# EAGLE design breakout (EAGLE 6.2)
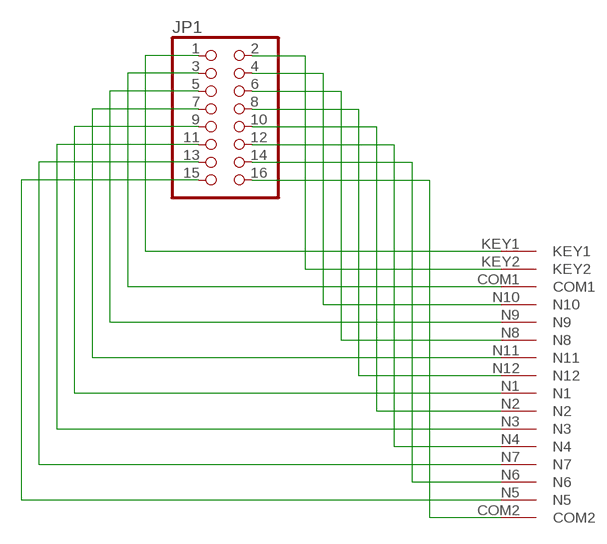
[diagram p0: schematic, sheet 1]

## Parts
JP1  PINHD-2X8  [2X08]
U$1  CON_16X1  [CON_16X1]

## Nets
N$1: JP1.1 U$1.KEY1
N$2: JP1.2 U$1.KEY2
N$3: JP1.3 U$1.COM1
N$4: JP1.4 U$1.N10
N$5: JP1.5 U$1.N9
N$6: JP1.6 U$1.N8
N$7: JP1.7 U$1.N11
N$8: JP1.8 U$1.N12
N$9: JP1.9 U$1.N1
N$10: JP1.10 U$1.N2
N$11: JP1.11 U$1.N3
N$12: JP1.12 U$1.N4
N$13: JP1.13 U$1.N7
N$14: JP1.14 U$1.N6
N$15: JP1.15 U$1.N5
N$16: JP1.16 U$1.COM2

## Library data of the parts
JP1 = pinhead:PINHD-2X8: PIN HEADER
U$1 = matt4eagle:CON_16X1

## Board
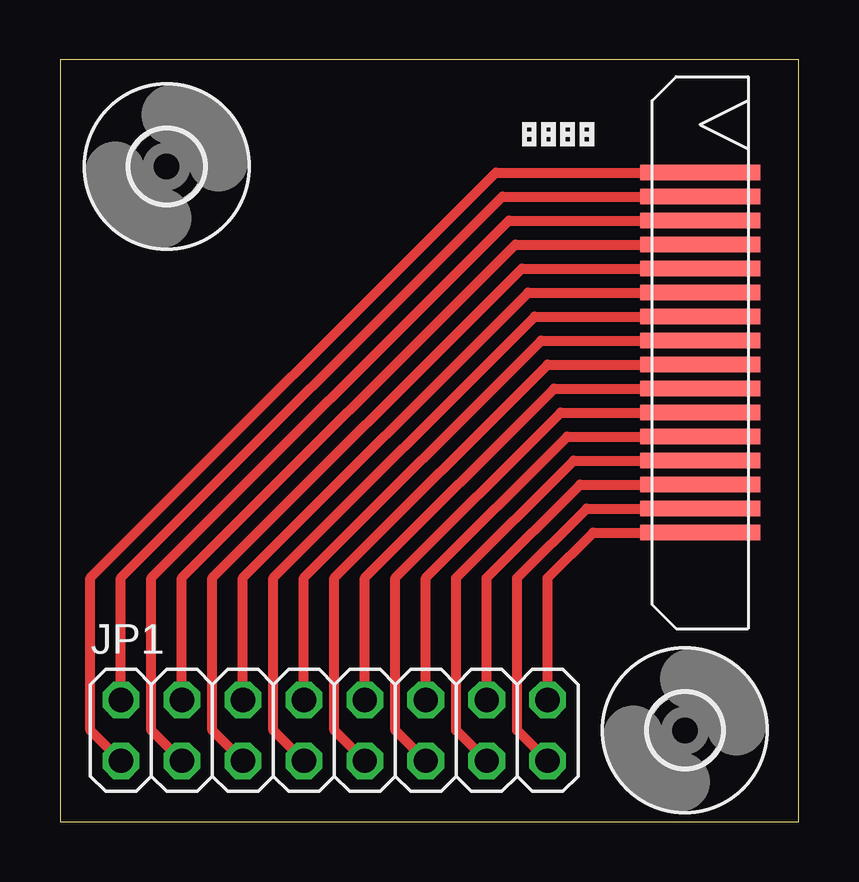
[diagram p1: board, top side]

Size 30.79 x 31.74 mm. Coordinates in mm from the lower left corner, seen from the top.
Outline: 0,0 30.79,0 30.79,31.74 0,31.74 0,0
Copper layers (1*16): Top 0.035mm / dielectric 1.5mm / Bottom 0.035mm
Design rules: minimum track width 0.15mm, minimum drill 0.3mm, track to track 0.15mm, track to pad 0.15mm, pad to pad 0.15mm, via to via 0.15mm, smd to smd 0mil, copper to edge 0.2mm, drill to drill 0.2mm, minimum pad ring 0.2mm, minimum via ring 0.2mm, stop-mask expansion 4mil, vias tented up to drill 0.8mm, thermal gap 0.15mm

### Footprints (pad centres in the part's own frame; a part is rotated, then mirrored left to right if it is on the bottom)
2X08 = drill 1.016 octagon: 1 -8.89,-1.27; 2 -8.89,1.27; 3 -6.35,-1.27; 4 -6.35,1.27; 5 -3.81,-1.27; 6 -3.81,1.27; 7 -1.27,-1.27; 8 -1.27,1.27; 9 1.27,-1.27; 10 1.27,1.27; 11 3.81,-1.27; 12 3.81,1.27; 13 6.35,-1.27; 14 6.35,1.27; 15 8.89,-1.27; 16 8.89,1.27
CON_16X1 = smd 5 x 0.635: COM1 0,6; COM2 0,-7; KEY1 0,8; KEY2 0,7; N1 0,0; N2 0,-1; N3 0,-2; N4 0,-3; N5 0,-6; N6 0,-5; N7 0,-4; N8 0,3; N9 0,4; N10 0,5; N11 0,2; N12 0,1
3,0 = hole 3: 0,0

### Placement (x,y rotation side)
JP1  11.43,3.81 0 top
U$1  26.67,19.05 0 top
U$2  [LP_NUMBER_SILK_TOP]  19.05,27.94 0 top
U$3  [3,0]  4.45,27.3 0 top
U$4  [3,0]  26.04,3.81 0 top

### Tracks (layer width: path | path; a pad name or v marks a point on that pad's centre or on a via)
N$1
  Top 0.406: JP1.1 1.27,3.81 1.27,10.16 18.16,27.05 U$1.KEY1
N$2
  Top 0.406: JP1.2 2.54,10.16 18.43,26.05 U$1.KEY2
N$3
  Top 0.406: JP1.3 3.81,3.81 3.81,10.16 18.7,25.05 U$1.COM1
N$4
  Top 0.406: JP1.4 5.08,10.16 18.97,24.05 U$1.N10
N$5
  Top 0.406: JP1.5 6.35,3.81 6.35,10.16 19.24,23.05 U$1.N9
N$6
  Top 0.406: JP1.6 7.62,10.16 19.51,22.05 U$1.N8
N$7
  Top 0.406: JP1.7 8.89,3.81 8.89,10.16 19.78,21.05 U$1.N11
N$8
  Top 0.406: JP1.8 10.16,10.16 20.05,20.05 U$1.N12
N$9
  Top 0.406: JP1.9 11.43,3.81 11.43,10.16 20.32,19.05 U$1.N1
N$10
  Top 0.406: JP1.10 12.7,10.16 20.59,18.05 U$1.N2
N$11
  Top 0.406: JP1.11 13.97,3.81 13.97,10.16 20.86,17.05 U$1.N3
N$12
  Top 0.406: JP1.12 15.24,10.16 21.13,16.05 U$1.N4
N$13
  Top 0.406: JP1.13 16.51,3.81 16.51,10.16 21.4,15.05 U$1.N7
N$14
  Top 0.406: JP1.14 17.78,10.16 21.67,14.05 U$1.N6
N$15
  Top 0.406: JP1.15 19.05,3.81 19.05,10.16 21.94,13.05 U$1.N5
N$16
  Top 0.406: JP1.16 20.32,10.16 22.21,12.05 U$1.COM2